# Altium project Sensor Subsystem Gas Monitoring.PrjPcb
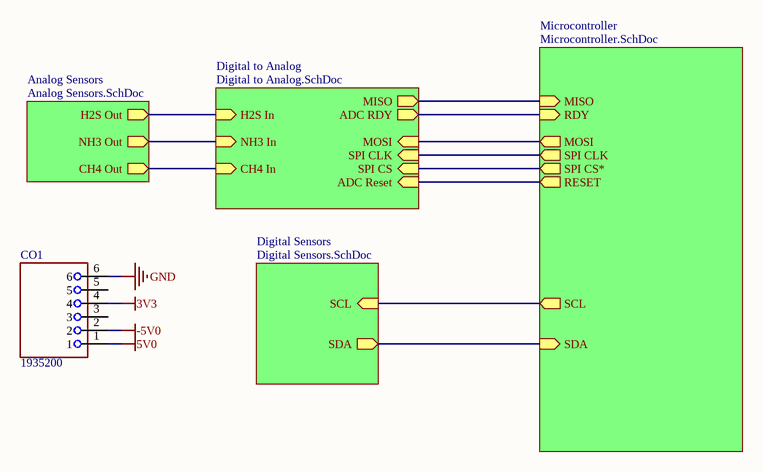
[diagram p0: Sensor Subsystem Gas Monitoring.SchDoc]
5 sheets, 72 parts. Net scope: hierarchical (ports join the sheet entries above them; power ports are global).
Board file: Sensor Subsystem.PcbDoc
Sheets:
  Sensor Subsystem Gas Monitoring.SchDoc
    Analog Sensors = Analog Sensors.SchDoc
    Digital Sensors = Digital Sensors.SchDoc
    Digital to Analog = Digital to Analog.SchDoc
    Microcontroller = Microcontroller.SchDoc

## Sheet Sensor Subsystem Gas Monitoring.SchDoc
size A; SheetNumber: 1; SheetTotal: 5

### Parts
CO1  1935200  [PHOENIX_1935200]

### Sub-sheets
Analog Sensors = Analog Sensors.SchDoc: H2S Out (out), CH4 Out (out), NH3 Out (out)
Digital Sensors = Digital Sensors.SchDoc: SDA (out), SCL (in)
Digital to Analog = Digital to Analog.SchDoc: H2S In (in), NH3 In (in), CH4 In (in), ADC RDY (out), SPI CS (in), SPI CLK (in), ADC Reset (in), MOSI (in), MISO (out)
Microcontroller = Microcontroller.SchDoc: SPI CLK (out), SPI CS* (out), MOSI (out), MISO (in), SDA (in), SCL (out), RESET (out), RDY (in)

### Nets
3V3: CO1.4
5V0: CO1.1
-5V0: CO1.2
GND: CO1.6
CH4 2: sheet Analog Sensors/CH4 Out, sheet Digital to Analog/CH4 In
CLK: sheet Digital to Analog/SPI CLK, sheet Microcontroller/SPI CLK
CS*: sheet Digital to Analog/SPI CS, sheet Microcontroller/SPI CS*
H2S 2: sheet Analog Sensors/H2S Out, sheet Digital to Analog/H2S In
MISO: sheet Digital to Analog/MISO, sheet Microcontroller/MISO
MOSI: sheet Digital to Analog/MOSI, sheet Microcontroller/MOSI
NH3 2: sheet Analog Sensors/NH3 Out, sheet Digital to Analog/NH3 In
RDY: sheet Digital to Analog/ADC RDY, sheet Microcontroller/RDY
RESET: sheet Digital to Analog/ADC Reset, sheet Microcontroller/RESET
NetM1_4: sheet Digital Sensors/SCL, sheet Microcontroller/SCL
NetM1_6: sheet Digital Sensors/SDA, sheet Microcontroller/SDA

Not connected (* = marked no-connect by the designer): CO1 3 5

### Library data of the parts
CO1 = 1935200: PCB terminal block - nominal current: 17.5 A - rated voltage (III/2): 400 V - nominal cross section: 1.5 mm² - pitch: 5 mm - number of positions: 6 - connection method: Screw connection with wire protector - mounting: Wave soldering - conductor/PCB connection direction: 0 ° - color: green - Pin layout: Linear pinning - Solder pin [P]: 3.5 mm; MF: Littelfuse; SnapEDA_Link: https://www.snapeda.com/parts/1935200/Littelfuse/view-part/?ref=snap; Package: None; Value: *; MP: 1935200; Check_prices: https://www.snapeda.com/parts/1935200/Littelfuse/view-part/?ref=eda

## Sheet Analog Sensors.SchDoc
size A; SheetNumber: 2; SheetTotal: 5
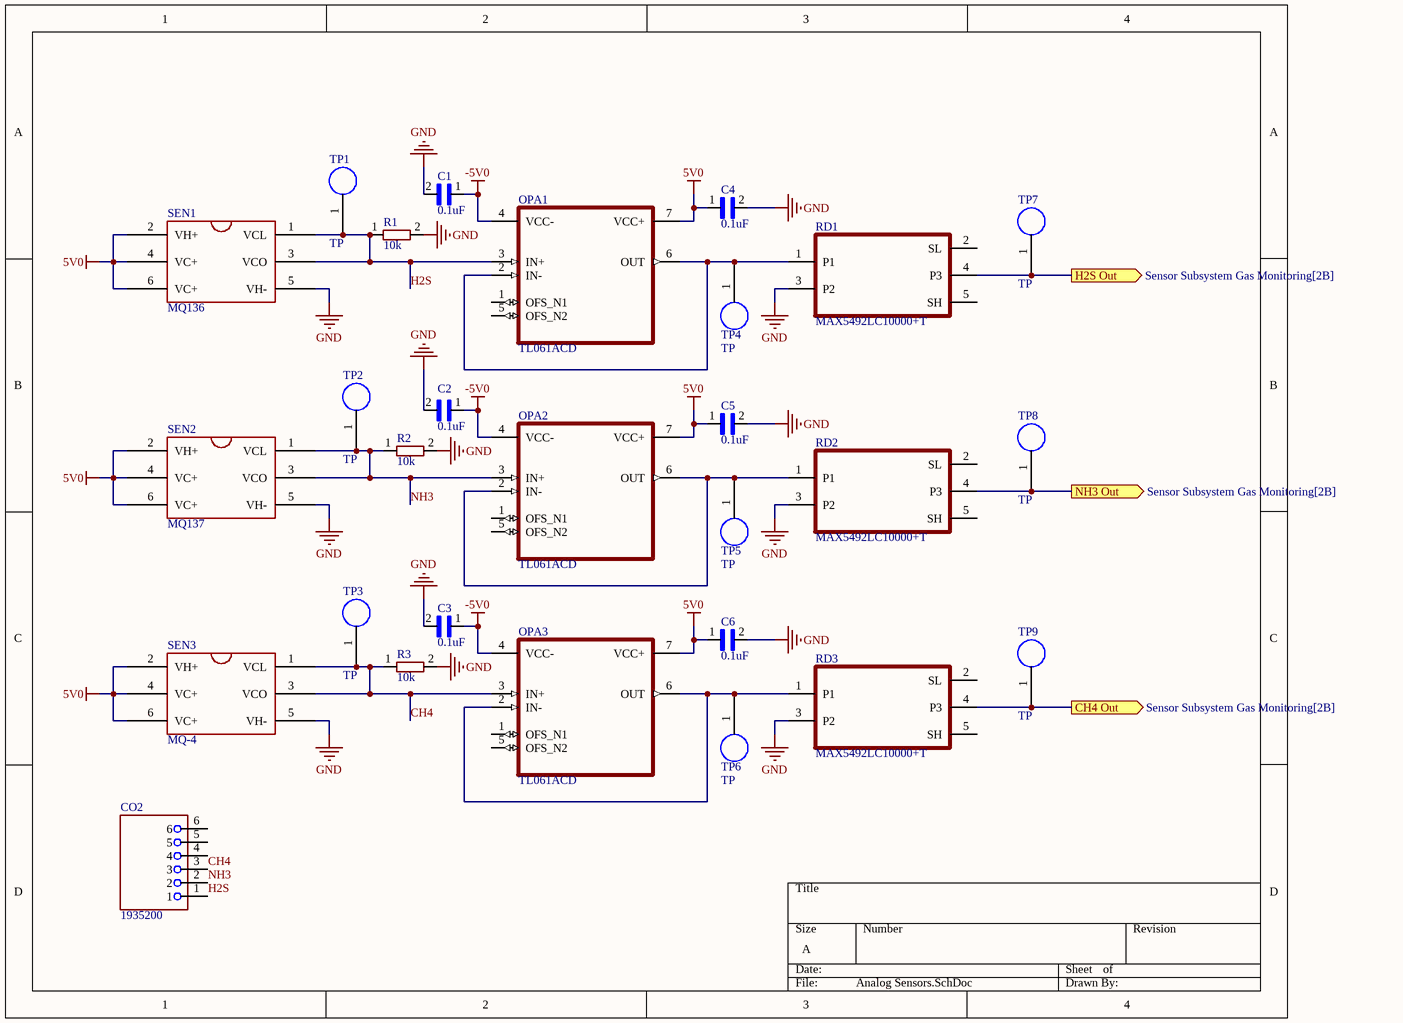
[diagram p1: Analog Sensors.SchDoc]

### Parts
C1  0.1uF  [0.1uF Capacitor]
C2  0.1uF  [0.1uF Capacitor]
C3  0.1uF  [0.1uF Capacitor]
C4  0.1uF  [0.1uF Capacitor]
C5  0.1uF  [0.1uF Capacitor]
C6  0.1uF  [0.1uF Capacitor]
CO2  1935200  [PHOENIX_1935200]
OPA1  TL061ACD  [SOIC127P599X175-8N]
OPA2  TL061ACD  [SOIC127P599X175-8N]
OPA3  TL061ACD  [SOIC127P599X175-8N]
R1  10k  [0603]
R2  10k  [0603]
R3  10k  [0603]
RD1  MAX5492LC10000+T  [SOT95P280X145-5N]
RD2  MAX5492LC10000+T  [SOT95P280X145-5N]
RD3  MAX5492LC10000+T  [SOT95P280X145-5N]
SEN1  MQ136  [MQ136]
SEN2  MQ137  [MQ137]
SEN3  MQ-4  [MQ4]
TP1  TP  [TestPoint]  (no BOM)
TP2  TP  [TestPoint]  (no BOM)
TP3  TP  [TestPoint]  (no BOM)
TP4  TP  [TestPoint]  (no BOM)
TP5  TP  [TestPoint]  (no BOM)
TP6  TP  [TestPoint]  (no BOM)
TP7  TP  [TestPoint]  (no BOM)
TP8  TP  [TestPoint]  (no BOM)
TP9  TP  [TestPoint]  (no BOM)

### Ports
CH4 Out (out, see Sensor Subsystem Gas Monitoring[2B]), H2S Out (out, see Sensor Subsystem Gas Monitoring[2B]), NH3 Out (out, see Sensor Subsystem Gas Monitoring[2B])

### Nets
5V0: C4.1 C5.1 C6.1 OPA1.7(VCC+) OPA2.7(VCC+) OPA3.7(VCC+) SEN1.2(VH+) SEN1.4(VC+) SEN1.6(VC+) SEN2.2(VH+) SEN2.4(VC+) SEN2.6(VC+) SEN3.2(VH+) SEN3.4(VC+) SEN3.6(VC+)
-5V0: C1.1 C2.1 C3.1 OPA1.4(VCC-) OPA2.4(VCC-) OPA3.4(VCC-)
GND: C1.2 C2.2 C3.2 C4.2 C5.2 C6.2 R1.2 R2.2 R3.2 RD1.3(P2) RD2.3(P2) RD3.3(P2) SEN1.5(VH-) SEN2.5(VH-) SEN3.5(VH-)
CH4: CO2.3 OPA3.3(IN+) R3.1 SEN3.1(VCL) SEN3.3(VCO) TP3.1
CH4 2: RD3.4(P3) TP9.1 ; port CH4 Out
H2S: CO2.1 OPA1.3(IN+) R1.1 SEN1.1(VCL) SEN1.3(VCO) TP1.1
H2S 2: RD1.4(P3) TP7.1 ; port H2S Out
NH3: CO2.2 OPA2.3(IN+) R2.1 SEN2.1(VCL) SEN2.3(VCO) TP2.1
NH3 2: RD2.4(P3) TP8.1 ; port NH3 Out
NetOPA1_2: OPA1.2(IN-) OPA1.6(OUT) RD1.1(P1) TP4.1
NetOPA2_2: OPA2.2(IN-) OPA2.6(OUT) RD2.1(P1) TP5.1
NetOPA3_2: OPA3.2(IN-) OPA3.6(OUT) RD3.1(P1) TP6.1

Not connected (* = marked no-connect by the designer): CO2 4 5 6; OPA1 1(OFS_N1) 5(OFS_N2); OPA2 1(OFS_N1) 5(OFS_N2); OPA3 1(OFS_N1) 5(OFS_N2); RD1 2(SL) 5(SH); RD2 2(SL) 5(SH); RD3 2(SL) 5(SH)

### Library data of the parts
C1-C6 = CC1206JRX7R9BB104: No Description Available; Mfr_Name: Yageo
CO2 = 1935200: as CO1 on sheet Sensor Subsystem Gas Monitoring; SnapEDA_Link: https://www.snapeda.com/parts/1935200/Littelfuse/view-part/?ref=snap; Package: None; Value: *; MP: 1935200; Check_prices: https://www.snapeda.com/parts/1935200/Littelfuse/view-part/?ref=eda
R1-R3 = RC0603FR-1310KL: http://octopart.com/rc0603fr-1310kl-yageo+%2F+phycomp-25905087; Package: None; Price: None; Value: *; MP: RC0603FR-1310KL; Availability: Unavailable
RD1-RD3 = MAX5492LC10000+T: Res NET 9.09K Ohm/910 Ohm 0.1% 0.5714W Â±35ppm/Â°C VOLT/D 5-Pin SOT-23 Gull Wing SMD T/R; MF: Maxim Integrated Products; SnapEDA_Link: https://www.snapeda.com/parts/MAX5492LC10000+T/Maxim+Integrated/view-part/?ref=snap; Package: None; Value: *; MP: MAX5492LC10000+T; Check_prices: https://www.snapeda.com/parts/MAX5492LC10000+T/Maxim+Integrated/view-part/?ref=eda
SEN1 = MQ136: Hydrogen Sulfide Sensor
SEN2 = MQ137: Ammonia Sensor
SEN3 = MQ-4: Methane Sensor
TP1-TP9 = TestPoint: Test point for voltage, current, ect.
OPA1-OPA3 = TL061ACD: Package: None; Price: None; Value: *; MP: TL061ACD; Availability: Unavailable

## Sheet Digital Sensors.SchDoc
size A; SheetNumber: 3; SheetTotal: 5
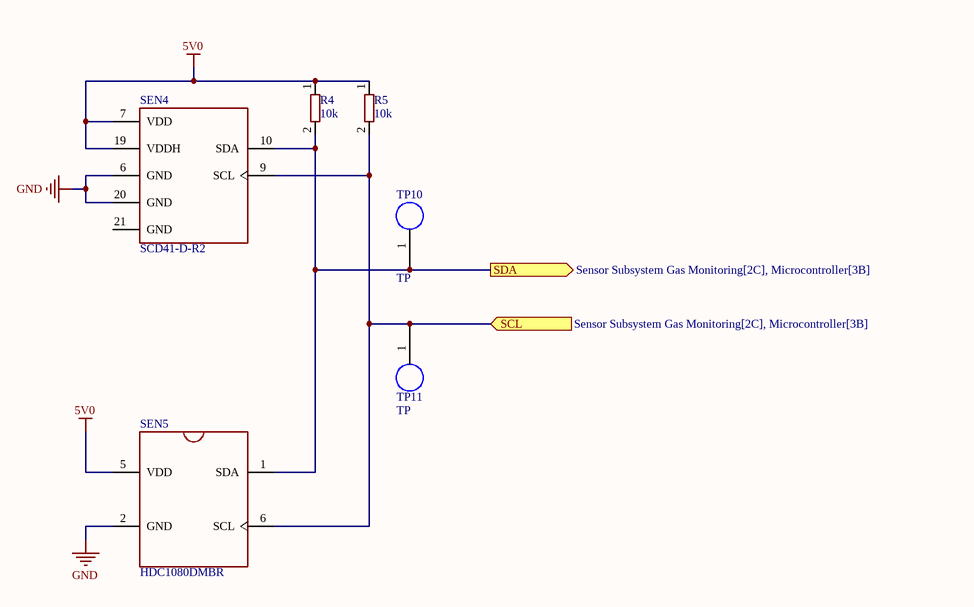
[diagram p2: Digital Sensors.SchDoc]

### Parts
R4  10k  [0603]
R5  10k  [0603]
SEN4  SCD41-D-R2  [XDCR_SCD41-D-R2]
SEN5  HDC1080DMBR  [SON100P300X300X80-7N]
TP10  TP  [TestPoint]  (no BOM)
TP11  TP  [TestPoint]  (no BOM)

### Ports
SCL (in, see Sensor Subsystem Gas Monitoring[2C], Microcontroller[3B]), SDA (out, see Sensor Subsystem Gas Monitoring[2C], Microcontroller[3B])

### Nets
5V0: R4.1 R5.1 SEN4.7(VDD) SEN4.19(VDDH) SEN5.5(VDD)
GND: SEN4.6(GND) SEN4.20(GND) SEN5.2(GND)
NetM1_4: R5.2 SEN4.9(SCL) SEN5.6(SCL) TP11.1 ; port SCL
NetM1_6: R4.2 SEN4.10(SDA) SEN5.1(SDA) TP10.1 ; port SDA

Not connected (* = marked no-connect by the designer): SEN4 21(GND)

### Library data of the parts
R4 R5 = RC0603FR-1310KL: as R1 on sheet Analog Sensors; Package: None; Price: None; Value: *; MP: RC0603FR-1310KL; Availability: Unavailable
SEN4 = SCD41-D-R2: Air Quality Sensor CO2 Sensor 2.5V/3.3V/5V 20-Pin SMD EP; MF: Sensirion AG; SnapEDA_Link: https://www.snapeda.com/parts/SCD41-D-R2/Sensirion+AG/view-part/?ref=snap; Availability: In Stock; MP: SCD41-D-R2; Price: None; Purchase-URL: https://pricing.snapeda.com/search/part/SCD41-D-R2/?ref=eda; Package: None; Check_prices: https://www.snapeda.com/parts/SCD41-D-R2/Sensirion+AG/view-part/?ref=eda; Value: *
SEN5 = HDC1080DMBR: Temperature and Humidity Sensor; MF: Texas Instruments; Price: None; Availability: Unavailable; SnapEDA_Link: https://www.snapeda.com/parts/HDC1080DMBR/Texas%20Instruments/view-part/472819/?ref=snap; Value: *; MP: HDC1080DMBR; Package: WSON-6 Texas Instruments; Purchase-URL: https://pricing.snapeda.com/search/part/HDC1080DMBR/?ref=eda
TP10 TP11 = TestPoint: Test point for voltage, current, ect.

## Sheet Digital to Analog.SchDoc
size A; SheetNumber: 4; SheetTotal: 5
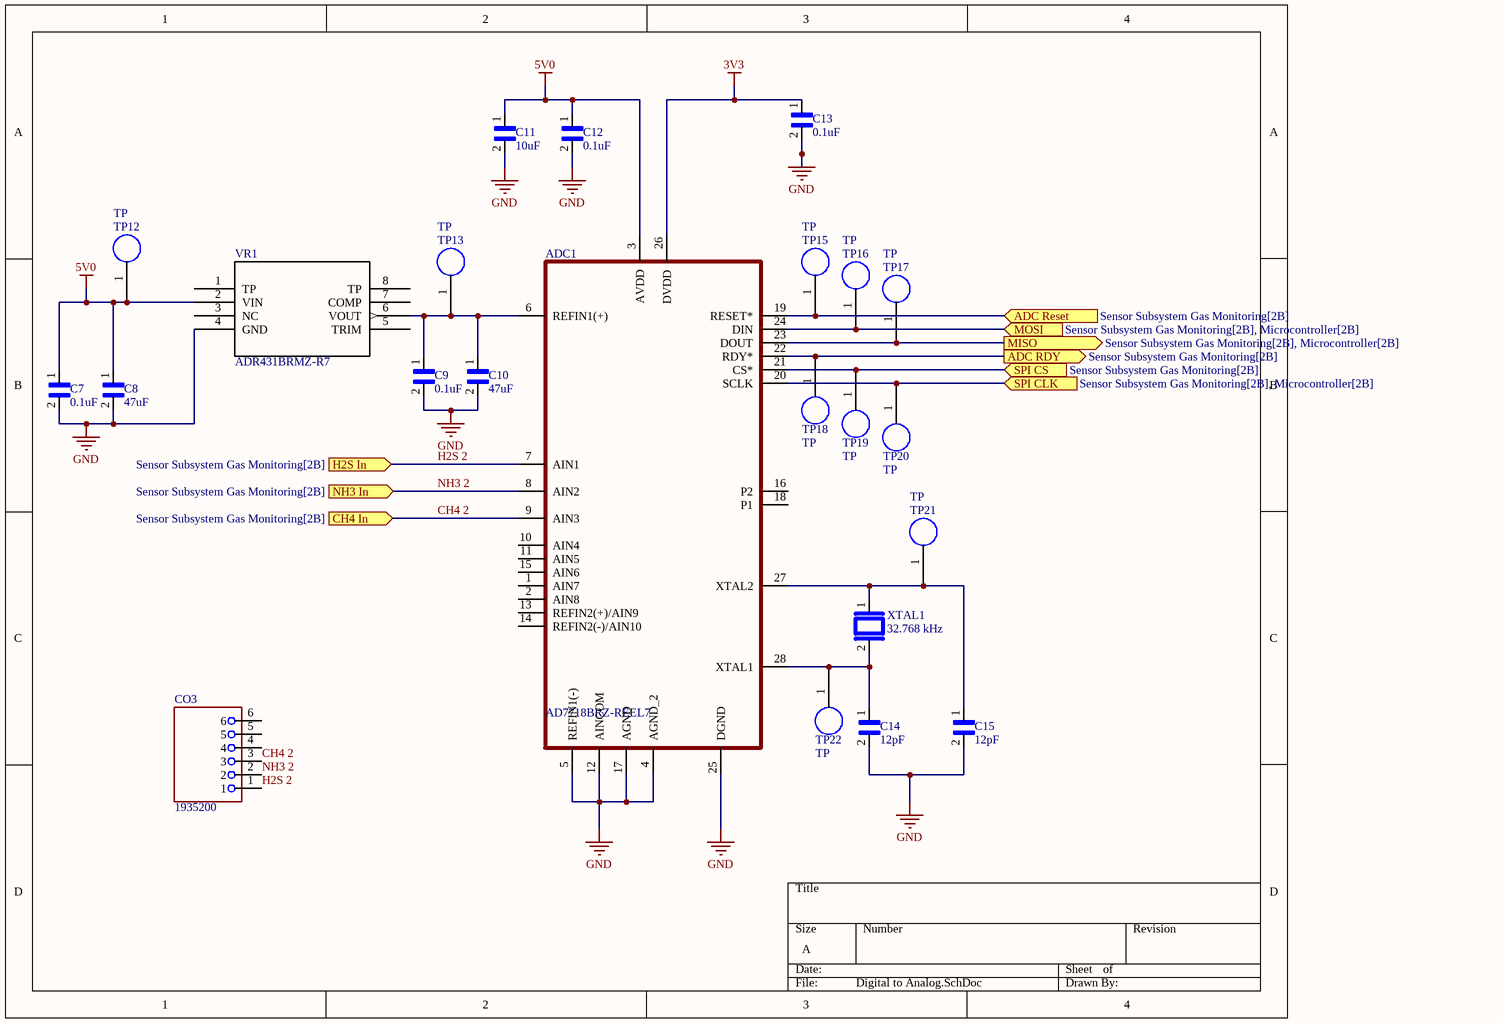
[diagram p3: Digital to Analog.SchDoc]

### Parts
ADC1  AD7718BRZ-REEL7  [SOIC127P1032X265-28N]
C7  0.1uF  [0.1uF Capacitor]
C8  47uF  [CAPC2012X135N]
C9  0.1uF  [0.1uF Capacitor]
C10  47uF  [CAPC2012X135N]
C11  10uF  [CAPC3216X190N]
C12  0.1uF  [0.1uF Capacitor]
C13  0.1uF  [0.1uF Capacitor]
C14  12pF  [CAPC1608X90N]
C15  12pF  [CAPC1608X90N]
CO3  1935200  [PHOENIX_1935200]
TP12  TP  [TestPoint]  (no BOM)
TP13  TP  [TestPoint]  (no BOM)
TP15  TP  [TestPoint]  (no BOM)
TP16  TP  [TestPoint]  (no BOM)
TP17  TP  [TestPoint]  (no BOM)
TP18  TP  [TestPoint]  (no BOM)
TP19  TP  [TestPoint]  (no BOM)
TP20  TP  [TestPoint]  (no BOM)
TP21  TP  [TestPoint]  (no BOM)
TP22  TP  [TestPoint]  (no BOM)
VR1  ADR431BRMZ-R7  [RM_8_ADI]
XTAL1  32.768 kHz  [XTAL_ABS07-32.768KHZ-T]

### Ports
ADC RDY (out, see Sensor Subsystem Gas Monitoring[2B]), ADC Reset (in, see Sensor Subsystem Gas Monitoring[2B]), CH4 In (in, see Sensor Subsystem Gas Monitoring[2B]), H2S In (in, see Sensor Subsystem Gas Monitoring[2B]), MISO (out, see Sensor Subsystem Gas Monitoring[2B], Microcontroller[2B]), MOSI (in, see Sensor Subsystem Gas Monitoring[2B], Microcontroller[2B]), NH3 In (in, see Sensor Subsystem Gas Monitoring[2B]), SPI CLK (in, see Sensor Subsystem Gas Monitoring[2B], Microcontroller[2B]), SPI CS (in, see Sensor Subsystem Gas Monitoring[2B])

### Nets
3V3: ADC1.26(DVDD) C13.1
5V0: ADC1.3(AVDD) C7.1 C8.1 C11.1 C12.1 TP12.1 VR1.2(VIN)
GND: ADC1.4(AGND_2) ADC1.5(REFIN1(-)) ADC1.12(AINCOM) ADC1.17(AGND) ADC1.25(DGND) C7.2 C8.2 C9.2 C10.2 C11.2 C12.2 C13.2 C14.2 C15.2 VR1.4(GND)
CH4 2: ADC1.9(AIN3) CO3.3 ; port CH4 In
CLK: ADC1.20(SCLK) TP20.1 ; port SPI CLK
CS*: ADC1.21(CS*) TP19.1 ; port SPI CS
H2S 2: ADC1.7(AIN1) CO3.1 ; port H2S In
MISO: ADC1.23(DOUT) TP17.1 ; port MISO
MOSI: ADC1.24(DIN) TP16.1 ; port MOSI
NH3 2: ADC1.8(AIN2) CO3.2 ; port NH3 In
RDY: ADC1.22(RDY*) TP18.1 ; port ADC RDY
RESET: ADC1.19(RESET*) TP15.1 ; port ADC Reset
NetADC1_6: ADC1.6(REFIN1(+)) C9.1 C10.1 TP13.1 VR1.6(VOUT)
NetADC1_27: ADC1.27(XTAL2) C15.1 TP21.1 XTAL1.1
NetADC1_28: ADC1.28(XTAL1) C14.1 TP22.1 XTAL1.2

Not connected (* = marked no-connect by the designer): ADC1 1(AIN7) 2(AIN8) 10(AIN4) 11(AIN5) 13(REFIN2(+)/AIN9) 14(REFIN2(-)/AIN10) 15(AIN6) 16(P2) 18(P1); CO3 4 5 6; VR1 1(TP) 3(NC) 5(TRIM) 7(COMP) 8(TP)

### Library data of the parts
ADC1 = AD7718BRZ-REEL7: 24-Bit, 8/10-Channel, Low Voltage, Low Power, Sigma Delta ADC; MF: Analog Devices; SnapEDA_Link: https://www.snapeda.com/parts/AD7718BRZ-REEL7/Analog+Devices/view-part/?ref=snap; Package: SOIC -28 Analog Devices; Value: *; MP: AD7718BRZ-REEL7; Check_prices: https://www.snapeda.com/parts/AD7718BRZ-REEL7/Analog+Devices/view-part/?ref=eda
C7 C9 C12 C13 = CC1206JRX7R9BB104: as C1 on sheet Analog Sensors
C8 C10 = CL21A476MQYNNNG: 47ÂµF Â±20% 6.3V Ceramic Capacitor X5R 0805 _2012 Metric_; MF: Samsung Electro-Mechanics; Digi-Key_Part_Number: 1276-6467-1-ND; MP: CL21A476MQYNNNG; SnapEDA_Link: https://www.snapeda.com/parts/CL21A476MQYNNNG/Samsung%20Electro-Mechanics/view-part/3597942/?ref=snap; Value: *; Package: 0805 Samsung; Digi-Key_Purchase_URL: https://www.digikey.com/product-detail/en/samsung-electro-mechanics/CL21A476MQYNNNG/1276-6467-1-ND/5958095?utm_source=snapeda&utm_medium=aggregator&utm_campaign=symbol
C11 = GRJ31CR61E106KE11L: CAP CER 10UF 25V X5R 1206; Package: None; Price: None; Value: *; MP: GRJ31CR61E106KE11L; Availability: Unavailable
C14 C15 = CGA3E2C0G1H120J080AA: Multilayer Ceramic Capacitor, CGA Series, 12 pF, - 5%, C0G / NP0, 50 V, 0603 [1608 Metric]; MF: TDK; SnapEDA_Link: https://www.snapeda.com/parts/CGA3E2C0G1H120J080AA/TDK/view-part/?ref=snap; Package: 1608 TDK; Value: *; MP: CGA3E2C0G1H120J080AA; Check_prices: https://www.snapeda.com/parts/CGA3E2C0G1H120J080AA/TDK/view-part/?ref=eda
CO3 = 1935200: as CO1 on sheet Sensor Subsystem Gas Monitoring; SnapEDA_Link: https://www.snapeda.com/parts/1935200/Littelfuse/view-part/?ref=snap; Package: None; Value: *; MP: 1935200; Check_prices: https://www.snapeda.com/parts/1935200/Littelfuse/view-part/?ref=eda
TP12 TP13 TP15-TP22 = TestPoint: Test point for voltage, current, ect.
VR1 = ADR431BRMZ-R7: No Description Available; Mfr_Name: Analog Devices Inc; RefDes: RefDes; Type: Type
XTAL1 = ABS07-32.768KHZ-T: 32.768 kHz Â±20ppm Crystal 12.5pF 70 kOhms 2-SMD, No Lead; MF: Abracon; Availability: In Stock; SnapEDA_Link: https://www.snapeda.com/parts/ABS07-32.768KHZ-T/Abracon+LLC/view-part/?ref=snap; MP: ABS07-32.768KHZ-T; Price: None; Value: *; Check_prices: https://www.snapeda.com/parts/ABS07-32.768KHZ-T/Abracon+LLC/view-part/?ref=eda; Purchase-URL: https://pricing.snapeda.com/search/part/ABS07-32.768KHZ-T/?ref=eda; Package: SMD-2 Abracon LLC

## Sheet Microcontroller.SchDoc
size A; SheetNumber: 5; SheetTotal: 5
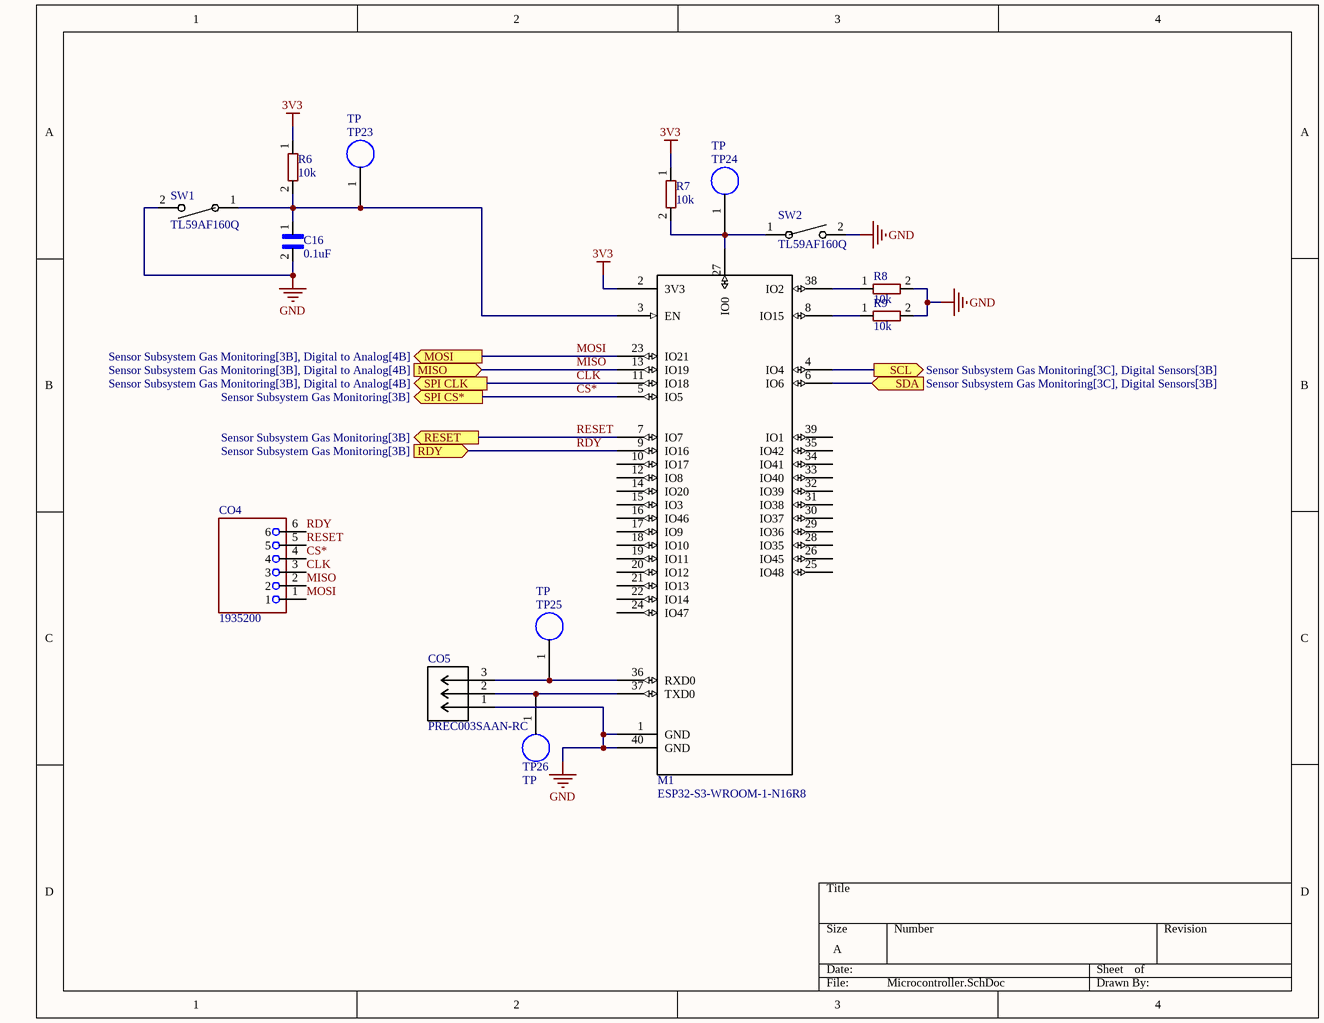
[diagram p4: Microcontroller.SchDoc]

### Parts
C16  0.1uF  [0.1uF Capacitor]
CO4  1935200  [PHOENIX_1935200]
CO5  PREC003SAAN-RC  [CONN_PREC003SAAN-RC_SUL]
M1  ESP32-S3-WROOM-1-N16R8  [ESP32-S3-WROOM-1_EXP]
R6  10k  [0603]
R7  10k  [0603]
R8  10k  [0603]
R9  10k  [0603]
SW1  TL59AF160Q  [SW_TL59AF160Q_EWI]
SW2  TL59AF160Q  [SW_TL59AF160Q_EWI]
TP23  TP  [TestPoint]  (no BOM)
TP24  TP  [TestPoint]  (no BOM)
TP25  TP  [TestPoint]  (no BOM)
TP26  TP  [TestPoint]  (no BOM)

### Ports
MISO (in, see Sensor Subsystem Gas Monitoring[3B], Digital to Analog[4B]), MOSI (out, see Sensor Subsystem Gas Monitoring[3B], Digital to Analog[4B]), RDY (in, see Sensor Subsystem Gas Monitoring[3B]), RESET (out, see Sensor Subsystem Gas Monitoring[3B]), SCL (out, see Sensor Subsystem Gas Monitoring[3C], Digital Sensors[3B]), SDA (in, see Sensor Subsystem Gas Monitoring[3C], Digital Sensors[3B]), SPI CLK (out, see Sensor Subsystem Gas Monitoring[3B], Digital to Analog[4B]), SPI CS* (out, see Sensor Subsystem Gas Monitoring[3B])

### Nets
3V3: M1.2(3V3) R6.1 R7.1
GND: C16.2 CO5.1 M1.1(GND) M1.40(GND) R8.2 R9.2 SW1.2 SW2.2
CLK: CO4.3 M1.11(IO18) ; port SPI CLK
CS*: CO4.4 M1.5(IO5) ; port SPI CS*
MISO: CO4.2 M1.13(IO19) ; port MISO
MOSI: CO4.1 M1.23(IO21) ; port MOSI
RDY: CO4.6 M1.9(IO16) ; port RDY
RESET: CO4.5 M1.7(IO7) ; port RESET
NetC16_1: C16.1 M1.3(EN) R6.2 SW1.1 TP23.1
NetCO5_2: CO5.2 M1.37(TXD0) TP26.1
NetCO5_3: CO5.3 M1.36(RXD0) TP25.1
NetM1_4: M1.4(IO4) ; port SCL
NetM1_6: M1.6(IO6) ; port SDA
NetM1_8: M1.8(IO15) R9.1
NetM1_27: M1.27(IO0) R7.2 SW2.1 TP24.1
NetM1_38: M1.38(IO2) R8.1

Not connected (* = marked no-connect by the designer): M1 10(IO17) 12(IO8) 14(IO20) 15(IO3) 16(IO46) 17(IO9) 18(IO10) 19(IO11) 20(IO12) 21(IO13) 22(IO14) 24(IO47) 25(IO48) 26(IO45) 28(IO35) 29(IO36) 30(IO37) 31(IO38) 32(IO39) 33(IO40) 34(IO41) 35(IO42) 39(IO1)

### Library data of the parts
C16 = CC1206JRX7R9BB104: as C1 on sheet Analog Sensors
CO4 = 1935200: as CO1 on sheet Sensor Subsystem Gas Monitoring; SnapEDA_Link: https://www.snapeda.com/parts/1935200/Littelfuse/view-part/?ref=snap; Package: None; Value: *; MP: 1935200; Check_prices: https://www.snapeda.com/parts/1935200/Littelfuse/view-part/?ref=eda
CO5 = PREC003SAAN-RC: No Description Available; Mfr_Name: Sullins; RefDes: RefDes; Type: Type
M1 = ESP32-S3-WROOM-1-N16R8: No Description Available; Mfr_Name: Espressif Systems; RefDes: RefDes; Type: Type
R6-R9 = RC0603FR-1310KL: as R1 on sheet Analog Sensors; Package: None; Price: None; Value: *; MP: RC0603FR-1310KL; Availability: Unavailable
SW1 SW2 = TL59AF160Q: No Description Available; Mfr_Name: E-Switch
TP23-TP26 = TestPoint: Test point for voltage, current, ect.

## Nets that join several sheets
3V3: Sensor Subsystem Gas Monitoring (CO1.4), Digital to Analog (ADC1.26 C13.1), Microcontroller (M1.2 R6.1 R7.1)
5V0: Sensor Subsystem Gas Monitoring (CO1.1), Analog Sensors (15 pins), Digital Sensors (5 pins), Digital to Analog (7 pins)
-5V0: Sensor Subsystem Gas Monitoring (CO1.2), Analog Sensors (6 pins)
GND: Sensor Subsystem Gas Monitoring (CO1.6), Analog Sensors (15 pins), Digital Sensors (SEN4.6 SEN4.20 SEN5.2), Digital to Analog (15 pins), Microcontroller (8 pins)
CH4 2: Analog Sensors (RD3.4 TP9.1), Digital to Analog (ADC1.9 CO3.3)
CLK: Digital to Analog (ADC1.20 TP20.1), Microcontroller (CO4.3 M1.11)
CS*: Digital to Analog (ADC1.21 TP19.1), Microcontroller (CO4.4 M1.5)
H2S 2: Analog Sensors (RD1.4 TP7.1), Digital to Analog (ADC1.7 CO3.1)
MISO: Digital to Analog (ADC1.23 TP17.1), Microcontroller (CO4.2 M1.13)
MOSI: Digital to Analog (ADC1.24 TP16.1), Microcontroller (CO4.1 M1.23)
NetM1_4: Digital Sensors (R5.2 SEN4.9 SEN5.6 TP11.1), Microcontroller (M1.4)
NetM1_6: Digital Sensors (R4.2 SEN4.10 SEN5.1 TP10.1), Microcontroller (M1.6)
NH3 2: Analog Sensors (RD2.4 TP8.1), Digital to Analog (ADC1.8 CO3.2)
RDY: Digital to Analog (ADC1.22 TP18.1), Microcontroller (CO4.6 M1.9)
RESET: Digital to Analog (ADC1.19 TP15.1), Microcontroller (CO4.5 M1.7)